# EAGLE design RoboSlider (EAGLE 7.3.0)
CNAME: Peter Moran
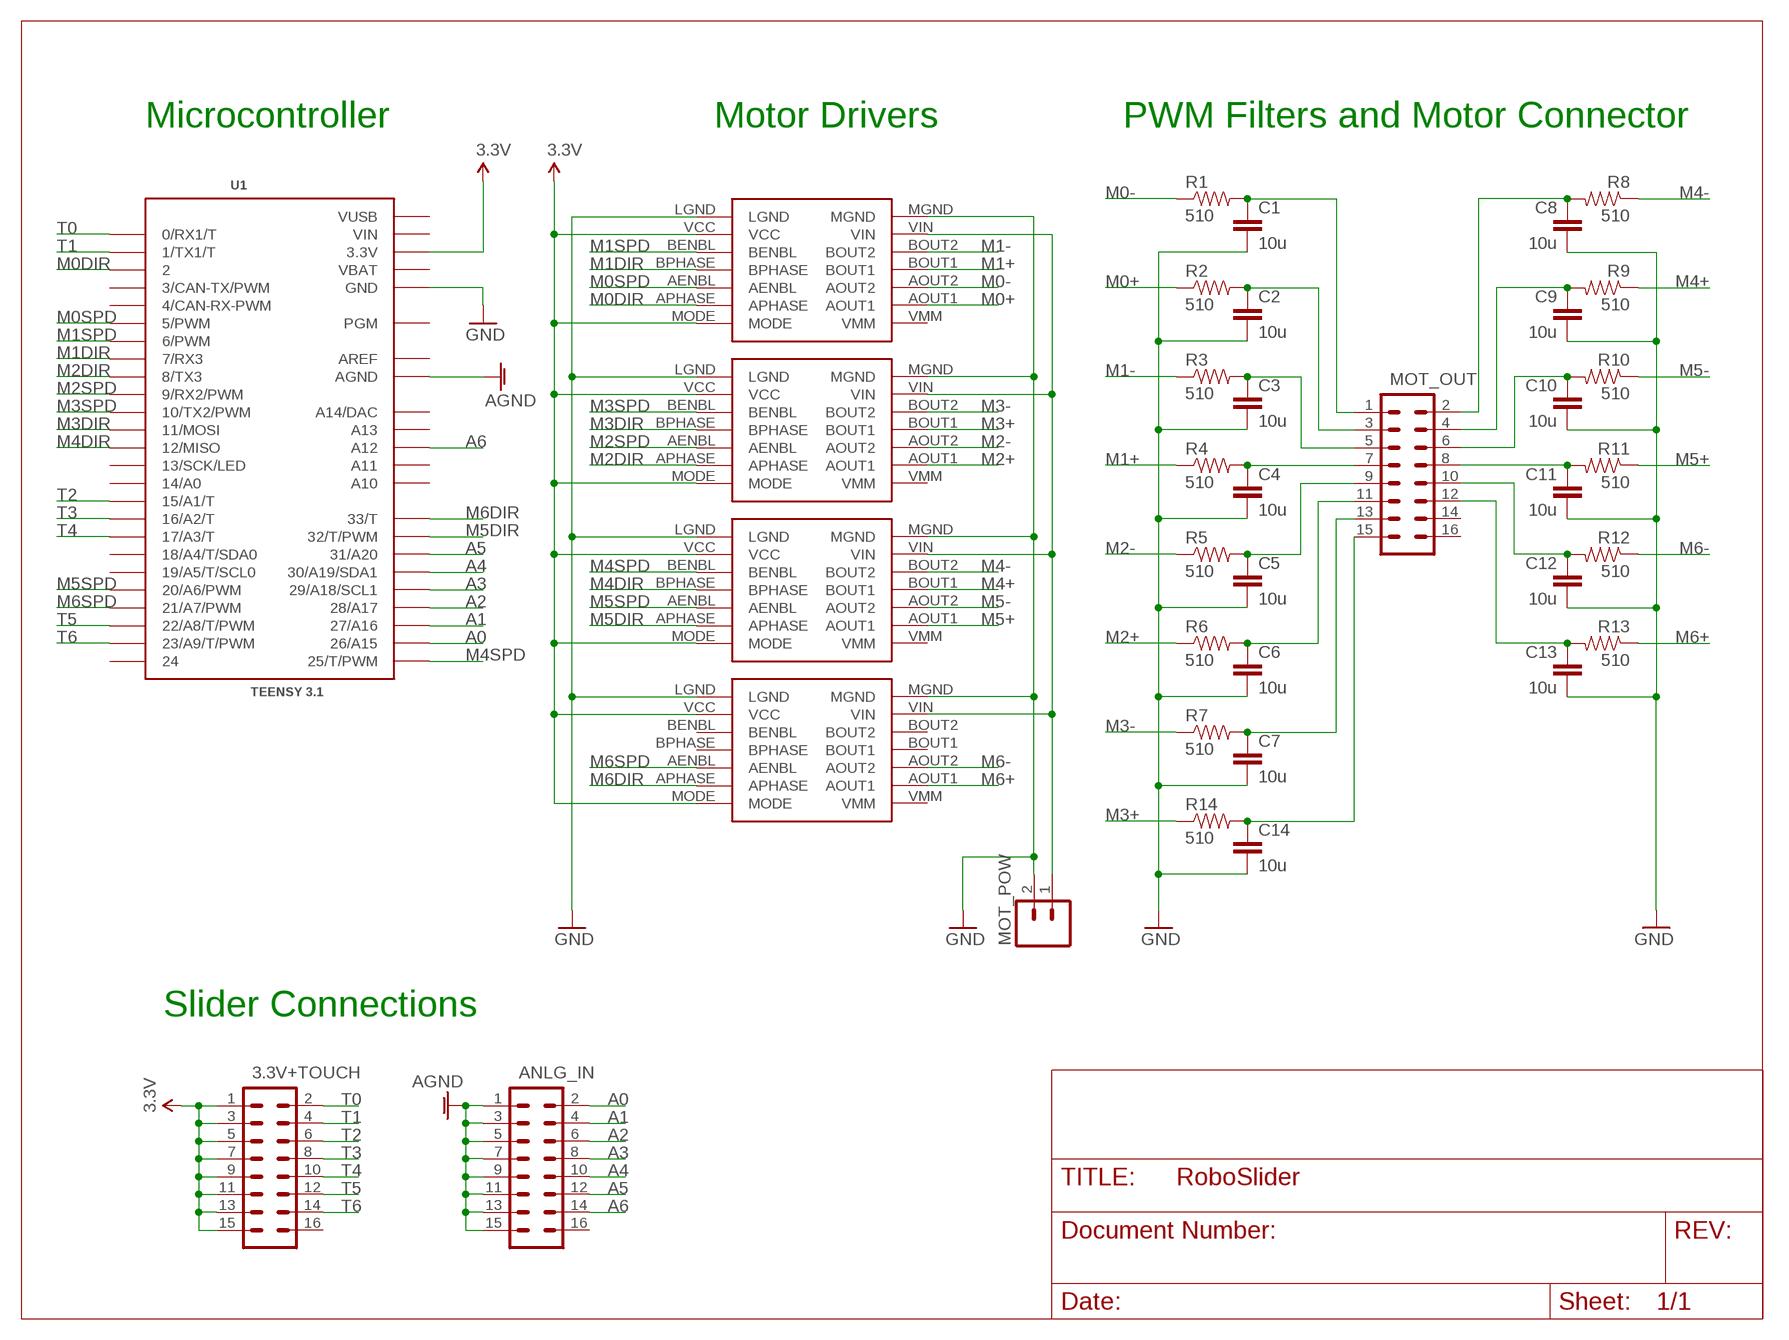
[diagram p0: schematic, sheet 1]

## Parts
3.3V+TOUCH  M08X2  [2X8]
ANLG_IN  M08X2  [2X8]
C1  10u  CAPPTH  [CAP-PTH-SMALL]
C2  10u  CAPPTH  [CAP-PTH-SMALL]
C3  10u  CAPPTH  [CAP-PTH-SMALL]
C4  10u  CAPPTH  [CAP-PTH-SMALL]
C5  10u  CAPPTH  [CAP-PTH-SMALL]
C6  10u  CAPPTH  [CAP-PTH-SMALL]
C7  10u  CAPPTH  [CAP-PTH-SMALL]
C8  10u  CAPPTH  [CAP-PTH-SMALL]
C9  10u  CAPPTH  [CAP-PTH-SMALL]
C10  10u  CAPPTH  [CAP-PTH-SMALL]
C11  10u  CAPPTH  [CAP-PTH-SMALL]
C12  10u  CAPPTH  [CAP-PTH-SMALL]
C13  10u  CAPPTH  [CAP-PTH-SMALL]
C14  10u  CAPPTH  [CAP-PTH-SMALL]
MOT_OUT  M08X2  [2X8]
MOT_POW  M02PTH  [1X02]
R1  510  RESISTORAXIAL-0.3  [AXIAL-0.3]
R2  510  RESISTORAXIAL-0.3  [AXIAL-0.3]
R3  510  RESISTORAXIAL-0.3  [AXIAL-0.3]
R4  510  RESISTORAXIAL-0.3  [AXIAL-0.3]
R5  510  RESISTORAXIAL-0.3  [AXIAL-0.3]
R6  510  RESISTORAXIAL-0.3  [AXIAL-0.3]
R7  510  RESISTORAXIAL-0.3  [AXIAL-0.3]
R8  510  RESISTORAXIAL-0.3  [AXIAL-0.3]
R9  510  RESISTORAXIAL-0.3  [AXIAL-0.3]
R10  510  RESISTORAXIAL-0.3  [AXIAL-0.3]
R11  510  RESISTORAXIAL-0.3  [AXIAL-0.3]
R12  510  RESISTORAXIAL-0.3  [AXIAL-0.3]
R13  510  RESISTORAXIAL-0.3  [AXIAL-0.3]
R14  510  RESISTORAXIAL-0.3  [AXIAL-0.3]
U1  TEENSY 3.1  TEENSY_3.1_ALL_PINS_AND_PADS  [TEENSY_3.1_ALLPINS]
U$1  POLOLU_MOTOR_DRV8835THROUGHHOLE  [POLOLU_MOTOR_DRV_DRV8835]
U$2  POLOLU_MOTOR_DRV8835THROUGHHOLE  [POLOLU_MOTOR_DRV_DRV8835]
U$3  POLOLU_MOTOR_DRV8835THROUGHHOLE  [POLOLU_MOTOR_DRV_DRV8835]
U$4  POLOLU_MOTOR_DRV8835THROUGHHOLE  [POLOLU_MOTOR_DRV_DRV8835]

## Nets
3.3V: 3.3V+TOUCH.1 3.3V+TOUCH.3 3.3V+TOUCH.5 3.3V+TOUCH.7 3.3V+TOUCH.9 3.3V+TOUCH.11 3.3V+TOUCH.13 3.3V+TOUCH.15 U1.3.3V U1.3.3V1(3.3V) U1.3.3V2(3.3V) U$1.MODE U$1.VCC U$2.MODE U$2.VCC U$3.MODE U$3.VCC U$4.MODE U$4.VCC
9V [high-amp]: MOT_POW.1 U$1.VIN U$2.VIN U$3.VIN U$4.VIN
A0: ANLG_IN.2 U1.26(26/A15)
A1: ANLG_IN.4 U1.27(27/A16)
A2: ANLG_IN.6 U1.28(28/A17)
A3: ANLG_IN.8 U1.29(29/A18/SCL1)
A4: ANLG_IN.10 U1.30(30/A19/SDA1)
A5: ANLG_IN.12 U1.31(31/A20)
A6: ANLG_IN.14 U1.A12
AGND: ANLG_IN.1 ANLG_IN.3 ANLG_IN.5 ANLG_IN.7 ANLG_IN.9 ANLG_IN.11 ANLG_IN.13 ANLG_IN.15 U1.AGND
GND [high-amp]: C1.2 C2.2 C3.2 C4.2 C5.2 C6.2 C7.2 C8.2 C9.2 C10.2 C11.2 C12.2 C13.2 C14.2 MOT_POW.2 U1.GND U1.GND1(GND) U1.GND2(GND) U$1.LGND U$1.MGND U$2.LGND U$2.MGND U$3.LGND U$3.MGND U$4.LGND U$4.MGND
M0+ [high-amp]: R2.P$1 U$1.AOUT1
M0- [high-amp]: R1.P$1 U$1.AOUT2
M0DIR: U1.2 U$1.APHASE
M0SPD: U1.5(5/PWM) U$1.AENBL
M1+ [high-amp]: R4.P$1 U$1.BOUT1
M1- [high-amp]: R3.P$1 U$1.BOUT2
M1DIR: U1.7(7/RX3) U$1.BPHASE
M1SPD: U1.6(6/PWM) U$1.BENBL
M2+ [high-amp]: R6.P$1 U$2.AOUT1
M2- [high-amp]: R5.P$1 U$2.AOUT2
M2DIR: U1.8(8/TX3) U$2.APHASE
M2SPD: U1.9(9/RX2/PWM) U$2.AENBL
M3+ [high-amp]: R14.P$1 U$2.BOUT1
M3- [high-amp]: R7.P$1 U$2.BOUT2
M3DIR: U1.11(11/MOSI) U$2.BPHASE
M3SPD: U1.10(10/TX2/PWM) U$2.BENBL
M4+ [high-amp]: R9.P$1 U$3.BOUT1
M4- [high-amp]: R8.P$1 U$3.BOUT2
M4DIR: U1.12(12/MISO) U$3.BPHASE
M4SPD: U1.25(25/T/PWM) U$3.BENBL
M5+ [high-amp]: R11.P$1 U$3.AOUT1
M5- [high-amp]: R10.P$1 U$3.AOUT2
M5DIR: U1.32(32/T/PWM) U$3.APHASE
M5SPD: U1.20/A6(20/A6/PWM) U$3.AENBL
M6+ [high-amp]: R13.P$1 U$4.AOUT1
M6- [high-amp]: R12.P$1 U$4.AOUT2
M6DIR: U1.33(33/T) U$4.APHASE
M6SPD: U1.21/A7(21/A7/PWM) U$4.AENBL
N$1 [high-amp]: C1.1 MOT_OUT.1 R1.P$2
N$2 [high-amp]: C2.1 MOT_OUT.3 R2.P$2
N$3 [high-amp]: C3.1 MOT_OUT.5 R3.P$2
N$4 [high-amp]: C4.1 MOT_OUT.7 R4.P$2
N$5 [high-amp]: C5.1 MOT_OUT.9 R5.P$2
N$6 [high-amp]: C6.1 MOT_OUT.11 R6.P$2
N$7 [high-amp]: C7.1 MOT_OUT.13 R7.P$2
N$8 [high-amp]: C8.1 MOT_OUT.2 R8.P$2
N$9 [high-amp]: C9.1 MOT_OUT.4 R9.P$2
N$10 [high-amp]: C10.1 MOT_OUT.6 R10.P$2
N$11 [high-amp]: C11.1 MOT_OUT.8 R11.P$2
N$12 [high-amp]: C12.1 MOT_OUT.10 R12.P$2
N$13 [high-amp]: C13.1 MOT_OUT.12 R13.P$2
N$15 [high-amp]: C14.1 MOT_OUT.15 R14.P$2
T0: 3.3V+TOUCH.2 U1.0(0/RX1/T)
T1: 3.3V+TOUCH.4 U1.1(1/TX1/T)
T2: 3.3V+TOUCH.6 U1.15/A1(15/A1/T)
T3: 3.3V+TOUCH.8 U1.16/A2(16/A2/T)
T4: 3.3V+TOUCH.10 U1.17/A3(17/A3/T)
T5: 3.3V+TOUCH.12 U1.22/A8(22/A8/T/PWM)
T6: 3.3V+TOUCH.14 U1.23/A9(23/A9/T/PWM)
Unconnected: 3.3V+TOUCH.16 ANLG_IN.16 MOT_OUT.14 MOT_OUT.16 U1.3(3/CAN-TX/PWM) U1.4(4/CAN-RX-PWM) U1.13(13/SCK/LED) U1.14/A0 U1.18/A4(18/A4/T/SDA0) U1.19/A5(19/A5/T/SCL0) U1.24 U1.A10 U1.A11 U1.A13 U1.A14(A14/DAC) U1.PGM U$1.VMM U$2.VMM U$3.VMM U$4.BENBL U$4.BOUT1 U$4.BOUT2 U$4.BPHASE U$4.VMM

## Notes on the sheet
- Microcontroller | Motor Drivers | PWM Filters and Motor Connector
- Slider Connections

## Power pins joined to a net without a drawn wire
AREF: U1.AREF
VBAT: U1.VBAT
VIN: U1.VIN
VUSB: U1.VUSB

## Library data of the parts
3.3V+TOUCH ANLG_IN MOT_OUT = SparkFun-Connectors:M08X2: .1" headers, two rows of 8 each
C1-C14 = SparkFun-Capacitors:CAP: Capacitor Standard 0603 ceramic capacitor, and 0.1" leaded capacitor.
MOT_POW = SparkFun-Connectors:M02: Standard 2-pin 0.1" header. Use with - straight break away headers ( PRT-00116) - right angle break away headers (PRT-00553) - swiss pins (PRT-00743) - machine pins (PRT-00117) - female headers (PRT-00115) Molex polarized connector foot print use with: PRT-08233 with associated crimp pins and housings. 2.54_SCREWTERM for use with PRT-10571. 3.5mm Screw Terminal footprints for PRT-08084 5mm Screw Terminal footprints for use with PRT-08432
R1-R14 = SparkFun-Resistors:RESISTOR: Resistor Basic schematic elements and footprints for 0603, 1206, and PTH resistors.
U1 = Teensy_3_Series_Board_v1.0:TEENSY_3.1_ALL_PINS_AND_PADS: Footprint for Teensy 3.1 board using all pads and all through-holes. Pads need a 2x7 0.1" SMD header.
U$1-U$4 = pololu:POLOLU_MOTOR_DRV8835

## Net classes
1 high-amp: width 0.584 mm

## Board
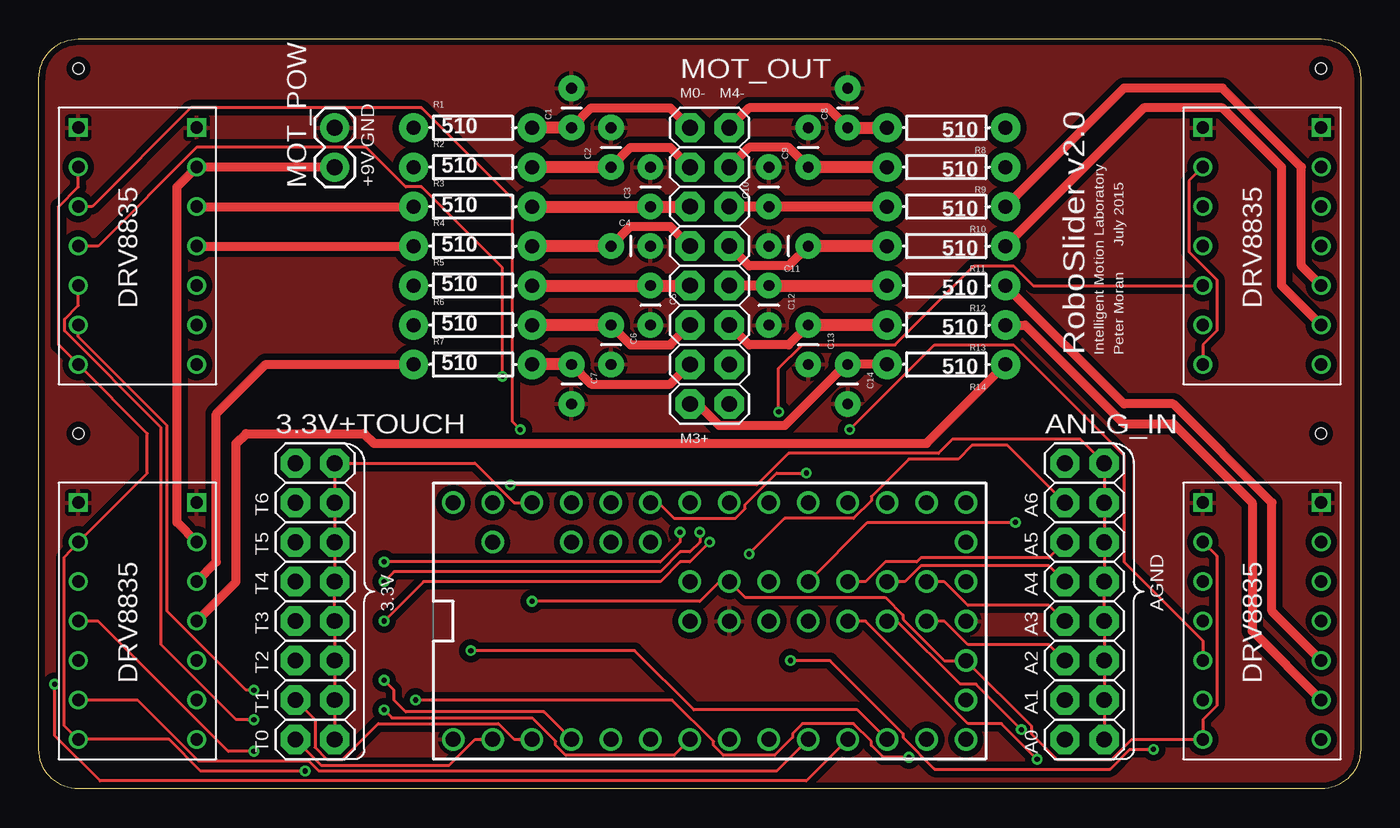
[diagram p1: board, top side]
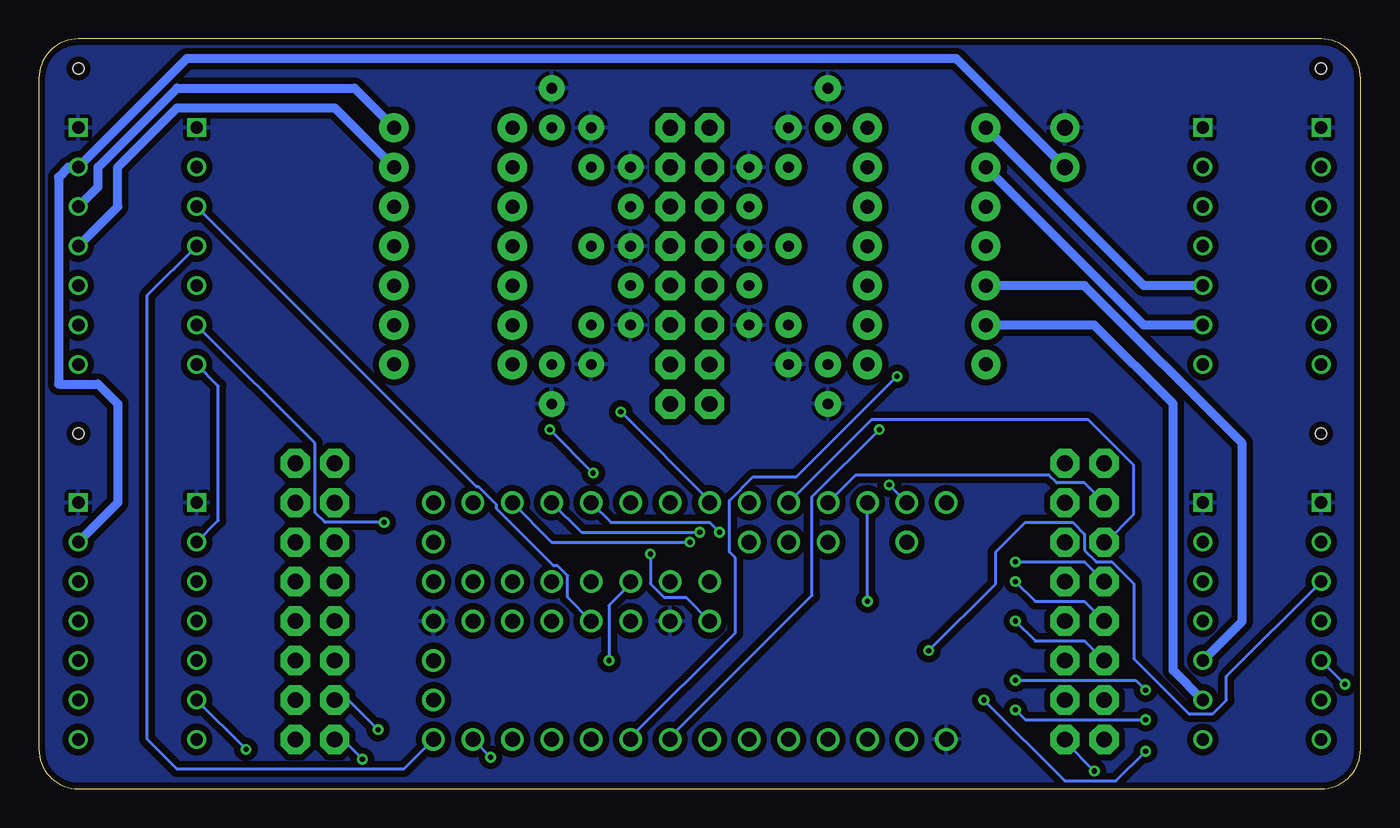
[diagram p2: board, bottom side, seen from below]

Size 85.09 x 48.26 mm. Coordinates in mm from the lower left corner, seen from the top.
Outline: 0,2.54 0,45.72 arc-90 2.54,48.26 82.55,48.26 arc-90 85.09,45.72 85.09,2.54 arc-90 82.55,0 2.54,0 arc-90 0,2.54
Copper layers (1*16): Top 0.0356mm / dielectric 1.5011mm / Bottom 0.0356mm
Design rules "oshpark-2layer *": minimum track width 8mil, minimum drill 13mil, track to track 6mil, track to pad 6mil, pad to pad 6mil, via to via 6mil, smd to smd 6mil, copper to edge 15mil, drill to drill 6mil, minimum pad ring 7mil, minimum via ring 7mil, stop-mask expansion 4mil, vias tented up to drill 0mil, thermal gap 10mil
Holes 0.7 mm at 2.54,46.35 82.55,46.35 82.55,22.86 2.54,22.86

### Footprints (pad centres in the part's own frame; a part is rotated, then mirrored left to right if it is on the bottom)
2X8 = drill 1.016 pad 1.88 octagon: 1 0,0; 2 0,2.54; 3 2.54,0; 4 2.54,2.54; 5 5.08,0; 6 5.08,2.54; 7 7.62,0; 8 7.62,2.54; 9 10.16,0; 10 10.16,2.54; 11 12.7,0; 12 12.7,2.54; 13 15.24,0; 14 15.24,2.54; 15 17.78,0; 16 17.78,2.54
CAP-PTH-SMALL = drill 0.7 pad 1.651: 1 0,0; 2 2.54,0
1X02 = drill 1.016 pad 1.88: 1 0,0; 2 2.54,0
AXIAL-0.3 = drill 0.9 pad 1.88: P$1 -3.81,0; P$2 3.81,0
TEENSY_3.1_ALLPINS = drill 0.965: 0 -7.62,15.24; 1 -7.62,12.7; 2 -7.62,10.16; 3 -7.62,7.62; 3.3V 7.62,12.7; 3.3V1 -2.54,-15.24; 3.3V2 2.54,0; 4 -7.62,5.08; 5 -7.62,2.54; 6 -7.62,0; 7 -7.62,-2.54; 8 -7.62,-5.08; 9 -7.62,-7.62; 10 -7.62,-10.16; 11 -7.62,-12.7; 12 -7.62,-15.24; 13 7.62,-15.24; 14/A0 7.62,-12.7; 15/A1 7.62,-10.16; 16/A2 7.62,-7.62; 17/A3 7.62,-5.08; 18/A4 7.62,-2.54; 19/A5 7.62,0; 20/A6 7.62,2.54; 21/A7 7.62,5.08; 22/A8 7.62,7.62; 23/A9 7.62,10.16; 24 0,-2.54; 25 0,-5.08; 26 0,-7.62; 27 0,-10.16; 28 0,-12.7; 29 2.54,-12.7; 30 2.54,-10.16; 31 2.54,-7.62; 32 2.54,-5.08; 33 2.54,-2.54; A10 5.08,7.62; A11 5.08,5.08; A12 0,2.54; A13 2.54,2.54; A14 5.08,-15.24; AGND 7.62,15.24; AREF 5.08,10.16; GND -7.62,17.78; GND1 0,-15.24; GND2 0,0; PGM 2.54,-15.24; VBAT -5.08,-15.24; VIN 7.62,17.78; VUSB 5.08,15.24
POLOLU_MOTOR_DRV_DRV8835 = drill 0.8: AENBL 1.27,6.35; AOUT1 8.89,3.81; AOUT2 8.89,6.35; APHASE 1.27,3.81; BENBL 1.27,11.43; BOUT1 8.89,8.89; BOUT2 8.89,11.43; BPHASE 1.27,8.89; MODE 1.27,1.27; VCC 1.27,13.97; VIN 8.89,13.97; VMM 8.89,1.27 | drill 0.8 square: LGND 1.27,16.51; MGND 8.89,16.51

### Placement (x,y rotation side)
3.3V+TOUCH  19.05,3.17 90 top
ANLG_IN  68.58,3.17 90 top
C1  34.29,42.55 90 top
C2  36.83,40.01 90 top
C3  39.37,37.47 90 top
C4  36.83,34.92 0 top
C5  39.37,32.38 270 top
C6  36.83,29.84 270 top
C7  34.29,27.3 270 top
C8  52.07,42.55 90 top
C9  49.53,40.01 90 top
C10  46.99,37.47 90 top
C11  49.53,34.92 180 top
C12  46.99,32.38 270 top
C13  49.53,29.84 270 top
C14  52.07,27.3 270 top
MOT_OUT  41.91,42.55 270 top
MOT_POW  19.05,40.01 90 top
R1  27.94,42.55 0 top
R2  27.94,40.01 0 top
R3  27.94,37.47 0 top
R4  27.94,34.92 0 top
R5  27.94,32.38 0 top
R6  27.94,29.84 0 top
R7  27.94,27.3 0 top
R8  58.42,42.55 180 top
R9  58.42,40.01 180 top
R10  58.42,37.47 180 top
R11  58.42,34.92 180 top
R12  58.42,32.38 180 top
R13  58.42,29.84 180 top
R14  58.42,27.3 180 top
U1  44.45,10.79 90 top
U$1  1.27,26.04 0 top
U$2  1.27,1.91 0 top
U$3  73.66,26.04 0 top
U$4  73.66,1.91 0 top

### Tracks (layer width: path | path; a pad name or v marks a point on that pad's centre or on a via)
3.3V  (via drill 0.33)
  Top 0.203: U$1.VCC 2.54,38.73 1.27,37.47 1.27,28.57 U$1.MODE 6.99,22.86 6.99,20.32 U$2.VCC 1.62,14.89 1.62,4.06 2.51,3.17 U$2.MODE 8.38,3.17 10.41,1.14 v17.14,1.14 | 3.3V+TOUCH.1 3.3V+TOUCH.3 3.3V+TOUCH.5 3.3V+TOUCH.7 3.3V+TOUCH.9 3.3V+TOUCH.11 3.3V+TOUCH.13 3.3V+TOUCH.15 28.07,20.95 30.61,18.41 U1.3.3V | U$3.MODE 74.93,28.57 75.82,29.46 75.82,32.77 74.04,34.54 74.04,39.12 U$3.VCC | U$4.VCC 75.82,14.99 75.82,5.33 74.93,4.45 U$4.MODE 70.36,3.17 69.09,1.91 65.53,1.91 63.88,3.56 63.88,4.06 U1.3.3V1 58.29,8.26 55.63,10.92 55.63,11.18 54.48,12.32 45.47,12.32 U1.3.3V2 43.81,13.34 42.55,12.06 v31.75,12.06
  Bottom 0.203: U$3.MODE 73.53,25.91 73.53,17.27 U$4.VCC | v17.14,1.14 19.05,3.05 3.3V+TOUCH.1 | v31.75,12.06 U1.3.3V
9V
  Top 0.584: MOT_POW.1 U$1.VIN 8.89,38.73 8.89,17.14 U$2.VIN
  Bottom 0.584: MOT_POW.1 26.04,46.99 75.56,46.99 U$3.VIN 83.19,40.01 83.82,39.37 83.82,26.04 81.28,26.04 80.01,24.77 80.01,18.41 U$4.VIN
A0  (via drill 0.33)
  Top 0.203: U1.26 53.21,10.79 59.82,4.19 61.98,4.19 v64.26,1.91
  Bottom 0.203: v64.26,1.91 65.53,3.17 ANLG_IN.2
A1  (via drill 0.33)
  Top 0.203: U1.27 55.24,10.79 59.31,6.73 60.33,6.73 v63.25,3.81
  Bottom 0.203: v63.25,3.81 65.15,5.71 ANLG_IN.4
A2
  Top 0.203: U1.28 58.29,10.79 59.82,9.27 65.02,9.27 ANLG_IN.6
A3
  Top 0.203: U1.29 58.29,13.34 59.82,11.81 65.02,11.81 ANLG_IN.8
A4
  Top 0.203: U1.30 55.75,13.34 56.77,14.35 65.02,14.35 ANLG_IN.10
A5
  Top 0.203: U1.31 53.21,13.34 54.48,14.61 56.52,14.61 56.77,14.86 65.02,14.86 ANLG_IN.12
A6  (via drill 0.33)
  Top 0.203: ANLG_IN.14 62.36,22.1 60.07,22.1 59.18,21.21 56.01,21.21 53.59,18.8 53.59,18.54 52.45,17.4 48.01,17.4 v45.72,15.11
  Bottom 0.203: U1.A12 43.43,12.32 44.83,12.32 45.72,13.21 v45.72,15.11
AGND  (via drill 0.33)
  Top 0.203: ANLG_IN.1 ANLG_IN.3 ANLG_IN.5 ANLG_IN.7 ANLG_IN.9 ANLG_IN.11 ANLG_IN.13 ANLG_IN.15 67.06,22.48 58.8,22.48 57.91,21.59 48.26,21.59 46.23,19.56 v30.35,19.56
  Bottom 0.203: v30.35,19.56 U1.AGND
GND
  pour Top (isolate 0.406): 0,0 0,48.26 85.09,48.26 85.09,0
  pour Bottom (isolate 0.406): 0,0 0,48.26 85.09,48.26 85.09,0
M0+
  Bottom 0.584: U$1.AOUT1 13.97,29.84 R2.P$1
M0-
  Bottom 0.584: U$1.AOUT2 13.97,32.38 R1.P$1
M0DIR  (via drill 0.33)
  Top 0.203: U$1.APHASE 2.54,29.08 8.26,23.37 8.26,11.43 13.34,6.35 v13.84,6.35 | U1.2 32.51,4.95 23.62,4.95 22.86,5.71 22.86,6.35 v22.23,6.99
  Bottom 0.203: v22.23,6.99 14.48,6.99 v13.84,6.35
M0SPD  (via drill 0.33)
  Top 0.203: U$1.AENBL 2.54,31.11 1.65,30.23 1.65,29.46 7.87,23.24 7.87,9.27 12.7,4.45 v13.84,4.45 | U1.5 40.89,2.16 33.91,2.16 33.27,2.79 33.27,3.05 31.75,4.57 22.73,4.57 v22.23,5.08
  Bottom 0.203: v13.84,4.45 21.59,4.45 v22.23,5.08
M1+
  Top 0.584: U$1.BOUT1 R4.P$1
M1-
  Top 0.584: U$1.BOUT2 R3.P$1
M1DIR  (via drill 0.33)
  Top 0.203: U$1.BPHASE 3.81,34.92 10.16,41.27 21.08,41.27 23.62,38.73 24.64,38.73 29.84,33.53 v29.84,26.54
  Bottom 0.203: v29.84,26.54 36.32,20.07 39.12,20.07 40.64,18.54 40.64,15.24 40.26,14.86 40.26,10.03 46.99,3.3 U1.7
M1SPD  (via drill 0.33)
  Top 0.203: U$1.BENBL 3.43,37.47 9.78,43.81 24.64,43.81 30.48,37.97 30.48,23.62 v30.99,23.11
  Bottom 0.203: v30.99,23.11 35.31,18.8 35.31,12.45 44.45,3.3 U1.6
M2+
  Bottom 0.584: U$2.AOUT1 12.06,7.62 12.06,24.77 17.14,29.84 R6.P$1
M2-
  Bottom 0.584: U$2.AOUT2 7.62,10.79 7.62,22.23 17.78,32.38 R5.P$1
M2DIR
  Top 0.203: U$2.APHASE 6.35,5.71 10.29,1.78 17.4,1.78 18.03,1.14 47.5,1.14 U1.8
M2SPD  (via drill 0.33)
  Top 0.203: v1.02,6.73 1.02,3.43 3.94,0.51 49.4,0.51 U1.9
  Bottom 0.203: v1.02,6.73 U$2.AENBL
M3+
  Top 0.584: U$2.BOUT1 12.7,13.34 12.7,22.23 13.34,22.86 20.95,22.86 21.59,22.23 57.15,22.23 R14.P$1
M3-
  Top 0.584: U$2.BOUT2 11.43,14.61 11.43,24.13 14.61,27.3 R7.P$1
M3DIR  (via drill 0.33)
  Top 0.203: U$2.BPHASE 3.81,10.79 12.19,2.41 v13.84,2.41 | v24.26,5.71 40.77,5.71 43.43,3.05 43.43,2.79 44.07,2.16 47.37,2.16 48.51,3.3 48.51,3.56 49.15,4.19 52.45,4.19 53.59,3.05 53.59,2.79 54.36,2.03 v56.01,2.03
  Bottom 0.203: v24.26,5.71 19.05,0.51 15.75,0.51 v13.84,2.41 | U1.11 v56.01,2.03
M3SPD  (via drill 0.33)
  Top 0.203: v27.81,8.89 38.35,8.89 42.16,5.08 52.7,5.08 U1.10
  Bottom 0.203: U$2.BENBL 8.64,7.24 8.64,5.71 9.53,4.83 11.05,4.83 14.61,8.38 14.61,13.21 16,14.61 17.02,14.61 17.78,15.37 17.78,16.38 18.54,17.14 21.59,17.14 23.5,15.24 23.5,13.21 v27.81,8.89
M4+
  Bottom 0.584: U$3.BOUT1 80.01,37.47 80.01,40.01 76.2,43.81 66.04,43.81 R9.P$1
M4-
  Bottom 0.584: U$3.BOUT2 81.28,38.73 81.28,40.01 76.2,45.09 64.77,45.09 R8.P$1
M4DIR
  Bottom 0.203: U1.12 61.59,1.27 76.2,1.27 78.11,3.17 78.11,31.75 U$3.BPHASE
M4SPD
  Bottom 0.203: U$3.BENBL 56.9,19.43 56.77,19.43 55.63,18.29 55.63,18.03 51.94,14.35 51.69,14.35 51.05,13.72 51.05,12.32 U1.25
M5+
  Top 0.584: U$3.AOUT1 80.01,32.38 80.01,40.01 76.2,43.81 71.12,43.81 R11.P$1
M5-
  Top 0.584: U$3.AOUT2 81.28,33.66 81.28,40.01 76.2,45.09 69.85,45.09 R10.P$1
M5DIR  (via drill 0.33)
  Top 0.203: v62.87,17.14 53.34,17.14 U1.32
  Bottom 0.203: U$3.APHASE 67.31,22.23 67.31,17.78 66.67,17.14 v62.87,17.14
M5SPD  (via drill 0.33)
  Top 0.203: U$3.AENBL 64.01,32.38 62.74,33.66 60.2,33.66 55.12,28.57 49.15,28.57 47.62,27.05 v47.62,24.26
  Bottom 0.203: v47.62,24.26 41.91,18.54 U1.20/A6
M6+
  Top 0.584: R13.P$1 63.5,29.84 69.85,23.5 73.03,23.5 78.11,18.41 78.11,10.16 U$4.AOUT1
M6-
  Top 0.584: U$4.AOUT2 79.38,11.43 79.38,18.41 73.03,24.77 69.85,24.77 R12.P$1
M6DIR  (via drill 0.33)
  Top 0.203: v71.75,2.54 70.23,2.54 68.96,1.27 57.66,1.27 55.63,3.3 55.63,3.56 50.93,8.26 v48.39,8.26
  Bottom 0.203: v71.75,2.54 U$4.APHASE | v48.39,8.26 48.39,11.81 46.99,13.21 U1.33
M6SPD  (via drill 0.33)
  Top 0.203: U$4.AENBL 74.93,9.53 69.85,14.61 69.85,21.46 62.74,28.57 57.66,28.57 v52.2,23.11 | v49.4,20.32 47.5,20.32 45.47,18.29 45.47,18.03 44.83,17.4 40.89,17.4 39.88,18.41 U1.21/A7
  Bottom 0.203: v49.4,20.32 v52.2,23.11
N$1
  Top 0.584: C1.1 35.56,43.81 40.64,43.81 MOT_OUT.1
  Top 0.762: C1.1 R1.P$2
N$2
  Top 0.584: C2.1 38.1,41.27 40.64,41.27 MOT_OUT.3
  Top 0.762: C2.1 R2.P$2
N$3
  Top 0.762: R3.P$2 C3.1 MOT_OUT.5
N$4
  Top 0.584: C4.1 38.1,36.2 40.64,36.2 MOT_OUT.7
  Top 0.762: C4.1 R4.P$2
N$5
  Top 0.762: R5.P$2 C5.1 MOT_OUT.9
N$6
  Top 0.584: C6.1 38.1,28.57 40.64,28.57 MOT_OUT.11
  Top 0.762: C6.1 R6.P$2
N$7
  Top 0.584: C7.1 35.56,26.04 40.64,26.04 MOT_OUT.13
  Top 0.762: C7.1 R7.P$2
N$8
  Top 0.584: C8.1 50.8,43.81 45.72,43.81 MOT_OUT.2
  Top 0.762: C8.1 R8.P$2
N$9
  Top 0.584: C9.1 48.26,41.27 45.72,41.27 MOT_OUT.4
  Top 0.762: R9.P$2 C9.1
N$10
  Top 0.635: R10.P$2 C10.1 MOT_OUT.6
N$11
  Top 0.584: C11.1 48.26,33.66 45.72,33.66 MOT_OUT.8
  Top 0.762: R11.P$2 C11.1
N$12
  Top 0.635: C12.1 MOT_OUT.10
  Top 0.762: C12.1 R12.P$2
N$13
  Top 0.584: C13.1 48.26,28.57 45.72,28.57 MOT_OUT.12
  Top 0.762: R13.P$2 C13.1
N$15
  Top 0.584: R14.P$2 54.56,27.33 52.12,27.33 C14.1 51.82,27.18 48.01,23.37 43.81,23.37 42.44,24.74 41.91,24.74 MOT_OUT.15
T0
  Top 0.203: U1.0 28.07,3.17 26.42,1.52 18.16,1.52 3.3V+TOUCH.2
T1
  Top 0.203: U1.1 30.61,3.17 29.59,4.19 21.84,4.19 19.56,1.91 18.54,1.91 17.78,2.67 17.78,4.45 3.3V+TOUCH.4
T2  (via drill 0.33)
  Top 0.203: v43.18,15.88 41.91,14.61 41.27,14.61 40.01,13.34 24.77,13.34 v22.23,10.79
  Bottom 0.203: U1.15/A1 52.07,15.88 v43.18,15.88 | v22.23,10.79 20.95,9.53 17.78,9.53 3.3V+TOUCH.6
T3  (via drill 0.33)
  Top 0.203: v42.55,16.51 42.55,15.88 41.91,15.24 41.27,15.24 40.01,13.97 22.86,13.97 v22.23,13.34
  Bottom 0.203: U1.16/A2 50.16,16.51 v42.55,16.51 | v22.23,13.34 20.95,12.06 17.78,12.06 3.3V+TOUCH.8
T4  (via drill 0.33)
  Top 0.203: v41.27,16.51 41.27,15.88 40.01,14.61 v22.23,14.61
  Bottom 0.203: U1.17/A3 48.26,17.14 41.91,17.14 v41.27,16.51 | v22.23,14.61 17.78,14.61 3.3V+TOUCH.10
T5
  Bottom 0.203: U1.22/A8 31.5,23.75 17.53,23.75 14.61,20.83 14.61,17.65 16.38,15.88 3.3V+TOUCH.12
T6
  Bottom 0.203: U1.23/A9 32.51,20.19 20.07,20.19 19.56,19.68 17.78,19.68 3.3V+TOUCH.14

### Text on the board
tPlace: M0- | M4- | GND | +9V | July 2015 | RoboSlider v2.0 | Intelligent Motion Laboratory | Peter Moran | M3+ | T6 | A6 | T5 | A5 | T4 | A4 | T3 | 3.3V | A3 | AGND | T2 | A2 | T1 | A1 | T0 | A0